# Altium schematic sheet Top.SchDoc
size A
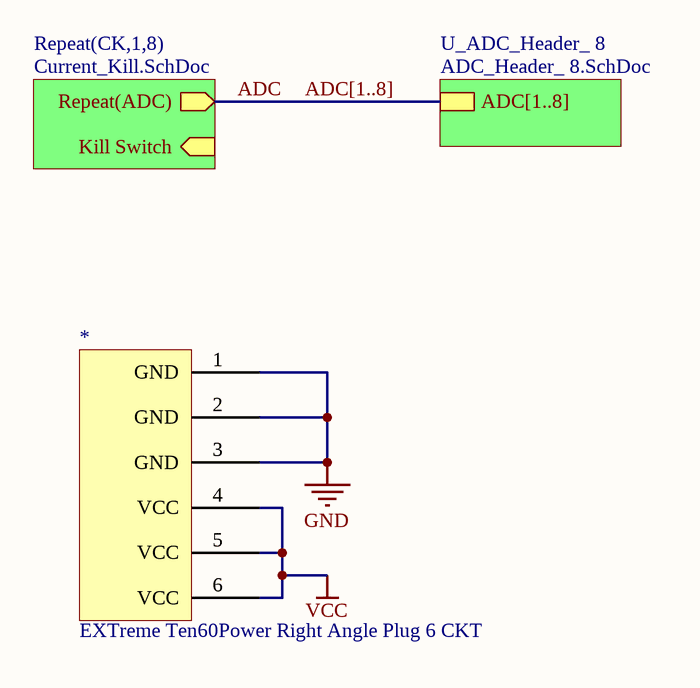
[diagram p0: Top.SchDoc]

## Parts
*  EXTreme Ten60Power Right Angle Plug 6 CKT  [EXTreme Ten60Power Right Angle Plug 6 CKT]

## Sub-sheets
Repeat(CK,1,8) = Current_Kill.SchDoc: Kill Switch (in), Repeat(ADC) (out)
U_ADC_Header_ 8 = ADC_Header_ 8.SchDoc: ADC[1..8]

## Nets
GND: *.1(GND) *.2(GND) *.3(GND)
VCC: *.4(VCC) *.5(VCC) *.6(VCC)
ADC: sheet Repeat(CK,1,8)/Repeat(ADC)  [also labelled ADC[1..8]]